# Altium schematic sheet Peripherals.SchDoc
size 420 x 297 mm
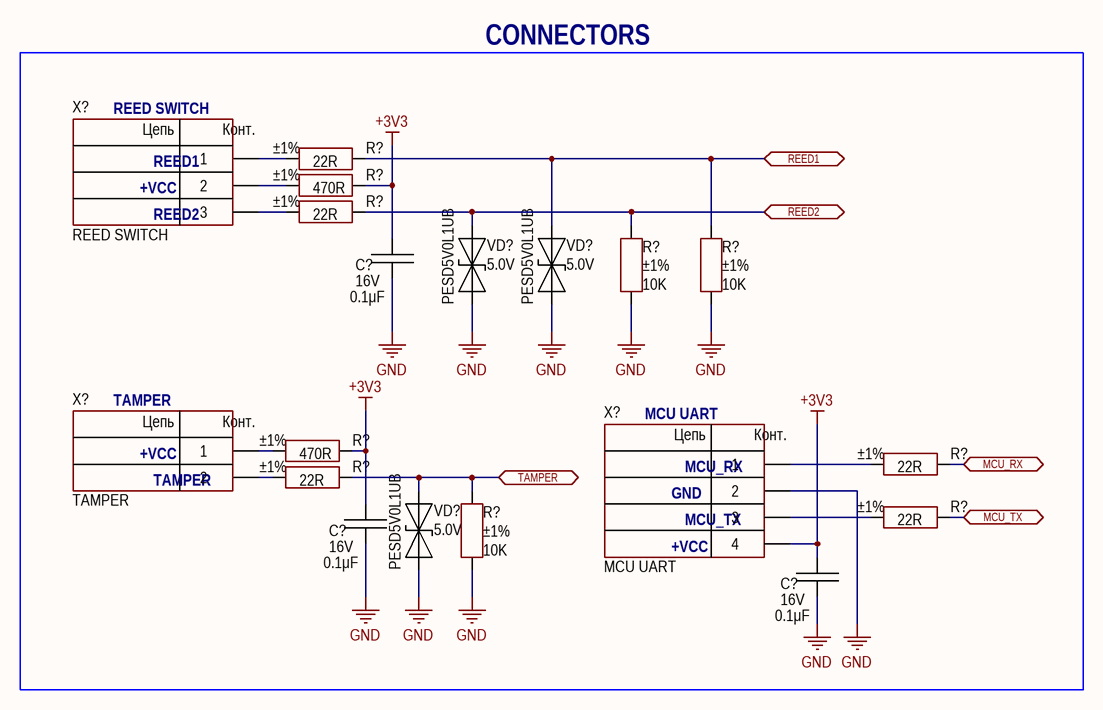
[diagram p0: Peripherals.SchDoc]

## Parts
(Parts that share a designator on the sheet are numbered #1, #2 ... from top to bottom, then left to right.)
C?#1  value 0.1μF  Voltage: 16V  [CAP: 0402]
C?#2  value 0.1μF  Voltage: 16V  [CAP: 0402]
C?#3  value 0.1μF  Voltage: 16V  [CAP: 0402]
R?#1  value 22R  Tolerance: ±1%  [RES: 0402]
R?#2  value 470R  Tolerance: ±1%  [RES: 0402]
R?#3  value 22R  Tolerance: ±1%  [RES: 0402]
R?#4  value 10K  Tolerance: ±1%  [RES: 0402]
R?#5  value 10K  Tolerance: ±1%  [RES: 0402]
R?#6  value 470R  Tolerance: ±1%  [RES: 0402]
R?#7  value 22R  Tolerance: ±1%  [RES: 0402]
R?#8  value 22R  Tolerance: ±1%  [RES: 0402]
R?#9  value 22R  Tolerance: ±1%  [RES: 0402]
R?#10  value 10K  Tolerance: ±1%  [RES: 0402]
VD?#1  Voltage: 5.0V  PartNumber: PESD5V0L1UB  [DIODE: SOD523]
VD?#2  Voltage: 5.0V  PartNumber: PESD5V0L1UB  [DIODE: SOD523]
VD?#3  Voltage: 5.0V  PartNumber: PESD5V0L1UB  [DIODE: SOD523]
X?#1  CommentText: REED SWITCH  [CON: 282834-3]
X?#2  CommentText: TAMPER  [CON: PLS-2]
X?#3  CommentText: MCU UART  [CON: PLS-4]

## Ports
MCU_RX (bidir), MCU_TX (bidir), REED1 (bidir), REED2 (bidir), TAMPER (bidir)

## Nets
+3V3: C?#1.1 C?#2.1 C?#3.1 R?#2.1 R?#6.1 X?#3.4
GND: C?#1.2 C?#2.2 C?#3.2 R?#4.1 R?#5.1 R?#10.1 VD?#1.1(A) VD?#2.1(A) VD?#3.1(A) X?#3.2
MCU_RX: R?#7.2 ; port MCU_RX
MCU_TX: R?#9.2 ; port MCU_TX
REED1: R?#1.2 R?#5.2 VD?#2.2(C) ; port REED1
REED2: R?#3.2 R?#4.2 VD?#1.2(C) ; port REED2
TAMPER: R?#8.2 R?#10.2 VD?#3.2(C) ; port TAMPER
NetR?#1_1: R?#1.1 X?#1.1
NetR?#2_2: R?#2.2 X?#1.2
NetR?#3_1: R?#3.1 X?#1.3
NetR?#6_2: R?#6.2 X?#2.1
NetR?#7_1: R?#7.1 X?#3.1
NetR?#8_1: R?#8.1 X?#2.2
NetR?#9_1: R?#9.1 X?#3.3

## Notes on the sheet
- CONNECTORS
- (near X?#1) REED SWITCH
- REED1
- +VCC
- REED2
- TAMPER
- MCU UART
- GND
- MCU_RX
- MCU_TX
- Author
- Manufacturer
- Date
- Page
- Total pages
- Size page
- A3
- Materials
- (in symbol KLS2-308V-2.54-03P-4S) Цепь; Конт.
- (in symbol PLS-2) Цепь; Конт.
- (in symbol PLS-4) Цепь; Конт.

## Library data of the parts
C?#1-C?#3 = Ceramic_0402: ±10% 16V Ceramic Capacitor X7R 0402 (1005 Metric); Manufacturer: Yageo; PartNumber: CC0402KRX7R7BB104; ValueManufacturerPartNumber: Ceramic capacitor, 0.1μF, X7R, ±10%, 16V, 0402, -55...+125°C; Package: 0402; HelpURL: https://www.digikey.com/product-detail/en/yageo/CC0402KRX7R7BB104/311-1338-1-ND/2103122; Temperature: -55...+125°C; TypeCapacitor: Ceramic capacitor; Tolerance: ±10%; TypeDielectric: X7R
R?#1 R?#3 R?#7-R?#9 = Resistor_0402: 22 Ohms ±1% 0.063W, 1/16W Chip Resistor 0402 (1005 Metric) Moisture Resistant Thick Film; Manufacturer: Yageo; PartNumber: RC0402FR-0722RL; ValueManufacturerPartNumber: Resistor film, 22R, ±1%, 0402, 0.063W, -55...+125°C; TypeResistor: Resistor film; Package: 0402; HelpURL: https://www.digikey.com/en/products/detail/yageo/RC0402FR-0722RL/726562; Temperature: -55...+125°C; Power: 0.063W
R?#2 R?#6 = Resistor_0402: 220 Ohms ±1% 0.063W, 1/16W Chip Resistor 0402 (1005 Metric) Moisture Resistant Thick Film; Manufacturer: Yageo; PartNumber: RC0402FR-07470RL; ValueManufacturerPartNumber: Resistor film, 470R, ±1%, 0402, 0.063W, -55...+125°C; TypeResistor: Resistor film; Package: 0402; HelpURL: https://www.digikey.com/en/products/detail/yageo/RC0402FR-07470RL/726619; Temperature: -55...+125°C; Power: 0.063W
R?#4 R?#5 R?#10 = Resistor_0402: 10 kOhms ±1% 0.063W, 1/16W Chip Resistor 0402 (1005 Metric) Moisture Resistant Thick Film; Manufacturer: Yageo; PartNumber: RC0402FR-0710KL; ValueManufacturerPartNumber: Resistor film, 10K, ±1%, 0402, 0.063W, -55...+125°C; TypeResistor: Resistor film; Package: 0402; HelpURL: https://www.digikey.com/en/products/detail/yageo/RC0402FR-0710KL/726523; Temperature: -55...+125°C; Power: 0.063W
VD?#1-VD?#3 = TVS_single: 12V Clamp 3.5A (8/20µs) Ipp Tvs Diode Surface Mount SOD-523; Manufacturer: Nexperia; TypeDiode: ESD TVS diode; Package: SOD-523; HelpURL: https://www.digikey.com/en/products/detail/nexperia-usa-inc/PESD5V0L1UB115/2092297; ValueManufacturerPartNumber: =TypeDiode+', '+Voltage+', '+Current+', '+VoltageDrop+', '+RecoveryTime+', '+Package+', '+Temperature; Temperature: -55...+150°C; Current: 3.5A
X?#1 = KLS2-308V-2.54-03P-4S: Connector; Manufacturer: KLS; TypeConnector: Block Terminal; VoltageMax: 500VAC; CurrentMax: 15A; Multichannel: 3pin; HelpURL: http://www.klsele.com/products/Terminal-blocks/560/278.html; ValueManufacturerPartNumber: =TypeConnector+', '+Multichannel+', '+Pitch+', '+VoltageMax+', '+CurrentMax; PartNumber: KLS2-308V-2.54-03P-4S
X?#2 = PLS-2: Pin Header 2 pin Straight, 2.54mm Through Hole.; Manufacturer: KLS; ValueManufacturerPartNumber: Connector, 2pin, 2.54mm, 500VAC, 3A; PartNumber: KLS1-207-1-02-S; TypeConnector: Connector; VoltageMax: 500VAC; CurrentMax: 3A; Multichannel: 2pin; HelpURL: https://www.klselectronic.com/kls1-207-2-54mm-pitch-male-pin-header-connectors; Pitch: 2.54mm
X?#3 = PLS-4: Pin Header 4 pin Straight, 2.54mm Through Hole.; Manufacturer: KLS; ValueManufacturerPartNumber: Connector, 4pin, 2.54mm, 500VAC, 3A; PartNumber: KLS1-207-1-02-S; TypeConnector: Connector; VoltageMax: 500VAC; CurrentMax: 3A; Multichannel: 4pin; HelpURL: https://www.klselectronic.com/kls1-207-2-54mm-pitch-male-pin-header-connectors; Pitch: 2.54mm